# EAGLE design quadstep-v020 (EAGLE 6.4)
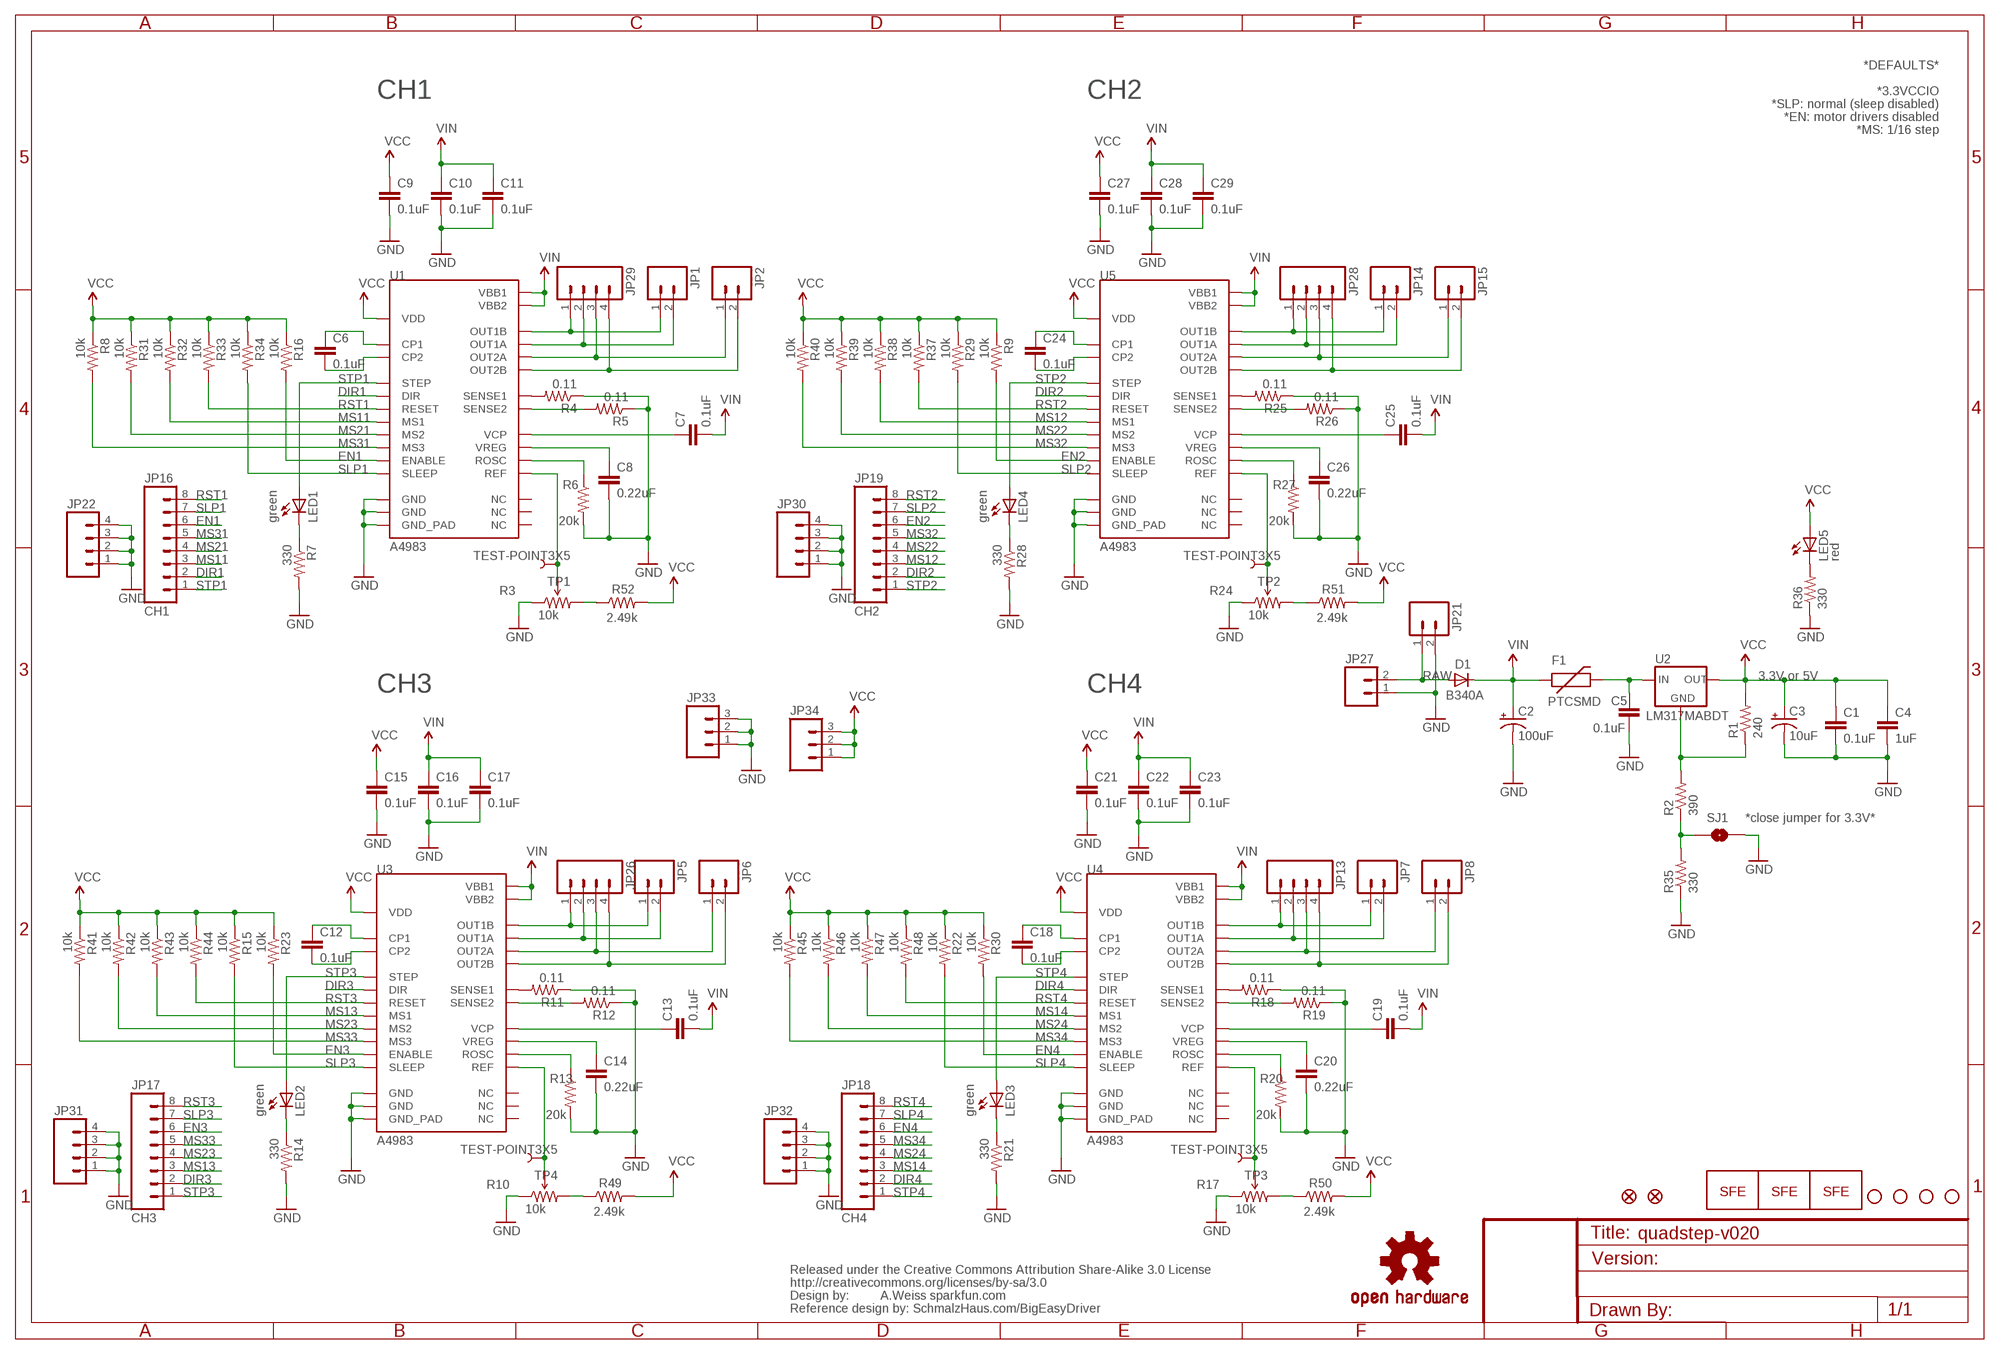
[diagram p0: schematic, sheet 1]

## Parts
C1  0.1uF  CAP0402-CAP  [0402-CAP]
C2  100uF  CAP_POLG  [PANASONIC_G]
C3  10uF  CAP_POL1206  [EIA3216]
C4  1uF  CAP0805  [0805]
C5  0.1uF  CAP0402-CAP  [0402-CAP]
C6  0.1uF  CAP0402-CAP  [0402-CAP]
C7  0.1uF  CAP0402-CAP  [0402-CAP]
C8  0.22uF  CAP0402-CAP  [0402-CAP]
C9  0.1uF  CAP0402-CAP  [0402-CAP]
C10  0.1uF  CAP0402-CAP  [0402-CAP]
C11  0.1uF  CAP0402-CAP  [0402-CAP]
C12  0.1uF  CAP0402-CAP  [0402-CAP]
C13  0.1uF  CAP0402-CAP  [0402-CAP]
C14  0.22uF  CAP0402-CAP  [0402-CAP]
C15  0.1uF  CAP0402-CAP  [0402-CAP]
C16  0.1uF  CAP0402-CAP  [0402-CAP]
C17  0.1uF  CAP0402-CAP  [0402-CAP]
C18  0.1uF  CAP0402-CAP  [0402-CAP]
C19  0.1uF  CAP0402-CAP  [0402-CAP]
C20  0.22uF  CAP0402-CAP  [0402-CAP]
C21  0.1uF  CAP0402-CAP  [0402-CAP]
C22  0.1uF  CAP0402-CAP  [0402-CAP]
C23  0.1uF  CAP0402-CAP  [0402-CAP]
C24  0.1uF  CAP0402-CAP  [0402-CAP]
C25  0.1uF  CAP0402-CAP  [0402-CAP]
C26  0.22uF  CAP0402-CAP  [0402-CAP]
C27  0.1uF  CAP0402-CAP  [0402-CAP]
C28  0.1uF  CAP0402-CAP  [0402-CAP]
C29  0.1uF  CAP0402-CAP  [0402-CAP]
CC_TEXT1  CREATIVE_COMMONS  [CREATIVE_COMMONS]
D1  B340A  DIODESMA  [SMA-DIODE]
F1  PTCSMD  [PTC-1206]
JP1  M023.5MM_LOCK  [SCREWTERMINAL-3.5MM-2_LOCK]
JP2  M023.5MM_LOCK  [SCREWTERMINAL-3.5MM-2_LOCK]
JP5  M023.5MM_LOCK  [SCREWTERMINAL-3.5MM-2_LOCK]
JP6  M023.5MM_LOCK  [SCREWTERMINAL-3.5MM-2_LOCK]
JP7  M023.5MM_LOCK  [SCREWTERMINAL-3.5MM-2_LOCK]
JP8  M023.5MM_LOCK  [SCREWTERMINAL-3.5MM-2_LOCK]
JP9  STAND-OFF  [STAND-OFF]
JP10  STAND-OFF  [STAND-OFF]
JP11  STAND-OFF  [STAND-OFF]
JP12  STAND-OFF  [STAND-OFF]
JP13  M04PTH  [1X04]
JP14  M023.5MM_LOCK  [SCREWTERMINAL-3.5MM-2_LOCK]
JP15  M023.5MM_LOCK  [SCREWTERMINAL-3.5MM-2_LOCK]
JP16  CH1  M08  [1X08]
JP17  CH3  M08  [1X08]
JP18  CH4  M08  [1X08]
JP19  CH2  M08  [1X08]
JP20  LOGO-SFENEW  [SFE-NEW-WEBLOGO]
JP21  M025MM  [SCREWTERMINAL-5MM-2]
JP22  M04PTH  [1X04]
JP23  LOGO-SFESK  [SFE-LOGO-FLAME]
JP24  FIDUCIAL1X2  [FIDUCIAL-1X2]
JP25  FIDUCIAL1X2  [FIDUCIAL-1X2]
JP26  M04PTH  [1X04]
JP27  M02PTH  [1X02]
JP28  M04PTH  [1X04]
JP29  M04PTH  [1X04]
JP30  M04PTH  [1X04]
JP31  M04PTH  [1X04]
JP32  M04PTH  [1X04]
JP33  M03PTH  [1X03]
JP34  M03PTH  [1X03]
LED1  green  LED0603  [LED-0603]
LED2  green  LED0603  [LED-0603]
LED3  green  LED0603  [LED-0603]
LED4  green  LED0603  [LED-0603]
LED5  red  LED0603  [LED-0603]
LOGO1  LOGO-SFENW2  [SFE-NEW-WEB]
R1  240  RESISTOR0402-RES  [0402-RES]
R2  390  RESISTOR0402-RES  [0402-RES]
R3  10k  TRIMPOTSMD  [TRIMPOT-3MM]
R4  0.11  RESISTOR2010  [R2010]
R5  0.11  RESISTOR2010  [R2010]
R6  20k  RESISTOR0402-RES  [0402-RES]
R7  330  RESISTOR0402-RES  [0402-RES]
R8  10k  RESISTOR0402-RES  [0402-RES]
R9  10k  RESISTOR0402-RES  [0402-RES]
R10  10k  TRIMPOTSMD  [TRIMPOT-3MM]
R11  0.11  RESISTOR2010  [R2010]
R12  0.11  RESISTOR2010  [R2010]
R13  20k  RESISTOR0402-RES  [0402-RES]
R14  330  RESISTOR0402-RES  [0402-RES]
R15  10k  RESISTOR0402-RES  [0402-RES]
R16  10k  RESISTOR0402-RES  [0402-RES]
R17  10k  TRIMPOTSMD  [TRIMPOT-3MM]
R18  0.11  RESISTOR2010  [R2010]
R19  0.11  RESISTOR2010  [R2010]
R20  20k  RESISTOR0402-RES  [0402-RES]
R21  330  RESISTOR0402-RES  [0402-RES]
R22  10k  RESISTOR0402-RES  [0402-RES]
R23  10k  RESISTOR0402-RES  [0402-RES]
R24  10k  TRIMPOTSMD  [TRIMPOT-3MM]
R25  0.11  RESISTOR2010  [R2010]
R26  0.11  RESISTOR2010  [R2010]
R27  20k  RESISTOR0402-RES  [0402-RES]
R28  330  RESISTOR0402-RES  [0402-RES]
R29  10k  RESISTOR0402-RES  [0402-RES]
R30  10k  RESISTOR0402-RES  [0402-RES]
R31  10k  RESISTOR0402-RES  [0402-RES]
R32  10k  RESISTOR0402-RES  [0402-RES]
R33  10k  RESISTOR0402-RES  [0402-RES]
R34  10k  RESISTOR0402-RES  [0402-RES]
R35  330  RESISTOR0402-RES  [0402-RES]
R36  330  RESISTOR0402-RES  [0402-RES]
R37  10k  RESISTOR0402-RES  [0402-RES]
R38  10k  RESISTOR0402-RES  [0402-RES]
R39  10k  RESISTOR0402-RES  [0402-RES]
R40  10k  RESISTOR0402-RES  [0402-RES]
R41  10k  RESISTOR0402-RES  [0402-RES]
R42  10k  RESISTOR0402-RES  [0402-RES]
R43  10k  RESISTOR0402-RES  [0402-RES]
R44  10k  RESISTOR0402-RES  [0402-RES]
R45  10k  RESISTOR0402-RES  [0402-RES]
R46  10k  RESISTOR0402-RES  [0402-RES]
R47  10k  RESISTOR0402-RES  [0402-RES]
R48  10k  RESISTOR0402-RES  [0402-RES]
R49  2.49k  RESISTOR0402-RES  [0402-RES]
R50  2.49k  RESISTOR0402-RES  [0402-RES]
R51  2.49k  RESISTOR0402-RES  [0402-RES]
R52  2.49k  RESISTOR0402-RES  [0402-RES]
SJ1  SOLDERJUMPERNO  [SJ_2S-NO]
TP1  TEST-POINT3X5  [PAD.03X.05]
TP2  TEST-POINT3X5  [PAD.03X.05]
TP3  TEST-POINT3X5  [PAD.03X.05]
TP4  TEST-POINT3X5  [PAD.03X.05]
U1  A4983  [QFN-28-5MM]
U2  LM317MABDT  V_REG_MC33269DT  [DPAK]
U3  A4983  [QFN-28-5MM]
U4  A4983  [QFN-28-5MM]
U5  A4983  [QFN-28-5MM]
U$1  OSHW-LOGOS  [OSHW-LOGO-S]

## Nets
DIR1: JP16.2 U1.P$19(DIR)
DIR2: JP19.2 U5.P$19(DIR)
DIR3: JP17.2 U3.P$19(DIR)
DIR4: JP18.2 U4.P$19(DIR)
EN1: JP16.6 R16.2 U1.P$2(ENABLE)
EN2: JP19.6 R9.2 U5.P$2(ENABLE)
EN3: JP17.6 R23.2 U3.P$2(ENABLE)
EN4: JP18.6 R30.2 U4.P$2(ENABLE)
GND: C1.2 C2.- C3.C(-) C4.2 C5.2 C8.2 C9.2 C10.2 C11.2 C14.2 C15.2 C16.2 C17.2 C20.2 C21.2 C22.2 C23.2 C26.2 C27.2 C28.2 C29.2 JP21.2 JP22.1 JP22.2 JP22.3 JP22.4 JP27.1 JP30.1 JP30.2 JP30.3 JP30.4 JP31.1 JP31.2 JP31.3 JP31.4 JP32.1 JP32.2 JP32.3 JP32.4 JP33.1 JP33.2 JP33.3 R3.1(CCW) R4.1 R5.1 R6.2 R7.2 R10.1(CCW) R11.1 R12.1 R13.2 R14.2 R17.1(CCW) R18.1 R19.1 R20.2 R21.2 R24.1(CCW) R25.1 R26.1 R27.2 R28.2 R35.1 R36.1 SJ1.2 U1.P$3(GND) U1.P$18(GND) U1.P$29(GND_PAD) U3.P$3(GND) U3.P$18(GND) U3.P$29(GND_PAD) U4.P$3(GND) U4.P$18(GND) U4.P$29(GND_PAD) U5.P$3(GND) U5.P$18(GND) U5.P$29(GND_PAD)
MS11: JP16.3 R32.2 U1.P$9(MS1)
MS12: JP19.3 R38.2 U5.P$9(MS1)
MS13: JP17.3 R43.2 U3.P$9(MS1)
MS14: JP18.3 R47.2 U4.P$9(MS1)
MS21: JP16.4 R31.2 U1.P$10(MS2)
MS22: JP19.4 R39.2 U5.P$10(MS2)
MS23: JP17.4 R42.2 U3.P$10(MS2)
MS24: JP18.4 R46.2 U4.P$10(MS2)
MS31: JP16.5 R8.2 U1.P$11(MS3)
MS32: JP19.5 R40.2 U5.P$11(MS3)
MS33: JP17.5 R41.2 U3.P$11(MS3)
MS34: JP18.5 R45.2 U4.P$11(MS3)
N$1: R1.1 R2.2 U2.1(GND)
N$2: JP7.1 JP13.1 U4.P$21(OUT1B)
N$3: JP1.2 JP29.2 U1.P$24(OUT1A)
N$4: C5.1 F1.2 U2.3(IN)
N$5: JP5.1 JP26.1 U3.P$21(OUT1B)
N$6: JP2.1 JP29.3 U1.P$26(OUT2A)
N$7: JP2.2 JP29.4 U1.P$1(OUT2B)
N$8: R4.2 U1.P$23(SENSE1)
N$9: R5.2 U1.P$27(SENSE2)
N$10: C7.1 U1.P$6(VCP)
N$11: C8.1 U1.P$8(VREG)
N$12: R6.1 U1.P$13(ROSC)
N$13: C6.1 U1.P$4(CP1)
N$14: R3.2(WIPER) TP1.P$1 U1.P$17(REF)
N$15: C6.2 U1.P$5(CP2)
N$16: R11.2 U3.P$23(SENSE1)
N$17: LED1.C R7.1
N$18: R12.2 U3.P$27(SENSE2)
N$19: C13.1 U3.P$6(VCP)
N$20: C14.1 U3.P$8(VREG)
N$21: R13.1 U3.P$13(ROSC)
N$22: R10.2(WIPER) TP4.P$1 U3.P$17(REF)
N$23: C12.1 U3.P$4(CP1)
N$24: R2.1 R35.2 SJ1.1
N$25: C12.2 U3.P$5(CP2)
N$26: LED2.C R14.1
N$27: LED5.C R36.2
N$28: R10.3(CW) R49.1
N$29: JP5.2 JP26.2 U3.P$24(OUT1A)
N$30: JP6.1 JP26.3 U3.P$26(OUT2A)
N$31: JP6.2 JP26.4 U3.P$1(OUT2B)
N$32: R18.2 U4.P$23(SENSE1)
N$33: R19.2 U4.P$27(SENSE2)
N$34: C19.1 U4.P$6(VCP)
N$35: C20.1 U4.P$8(VREG)
N$36: R20.1 U4.P$13(ROSC)
N$37: R17.2(WIPER) TP3.P$1 U4.P$17(REF)
N$38: C18.1 U4.P$4(CP1)
N$39: C18.2 U4.P$5(CP2)
N$40: LED3.C R21.1
N$41: JP14.1 JP28.1 U5.P$21(OUT1B)
N$42: JP7.2 JP13.2 U4.P$24(OUT1A)
N$43: JP8.1 JP13.3 U4.P$26(OUT2A)
N$44: JP8.2 JP13.4 U4.P$1(OUT2B)
N$45: R25.2 U5.P$23(SENSE1)
N$46: R26.2 U5.P$27(SENSE2)
N$47: C25.1 U5.P$6(VCP)
N$48: C26.1 U5.P$8(VREG)
N$49: R27.1 U5.P$13(ROSC)
N$50: R24.2(WIPER) TP2.P$1 U5.P$17(REF)
N$51: C24.1 U5.P$4(CP1)
N$52: C24.2 U5.P$5(CP2)
N$53: LED4.C R28.1
N$54: JP1.1 JP29.1 U1.P$21(OUT1B)
N$55: JP14.2 JP28.2 U5.P$24(OUT1A)
N$56: JP15.1 JP28.3 U5.P$26(OUT2A)
N$57: JP15.2 JP28.4 U5.P$1(OUT2B)
N$58: R17.3(CW) R50.1
N$59: R24.3(CW) R51.1
N$60: R3.3(CW) R52.1
RAW: D1.A JP21.1 JP27.2
RST1: JP16.8 R33.2 U1.P$12(RESET)
RST2: JP19.8 R37.2 U5.P$12(RESET)
RST3: JP17.8 R44.2 U3.P$12(RESET)
RST4: JP18.8 R48.2 U4.P$12(RESET)
SLP1: JP16.7 R34.2 U1.P$14(SLEEP)
SLP2: JP19.7 R29.2 U5.P$14(SLEEP)
SLP3: JP17.7 R15.2 U3.P$14(SLEEP)
SLP4: JP18.7 R22.2 U4.P$14(SLEEP)
STP1: JP16.1 LED1.A U1.P$16(STEP)
STP2: JP19.1 LED4.A U5.P$16(STEP)
STP3: JP17.1 LED2.A U3.P$16(STEP)
STP4: JP18.1 LED3.A U4.P$16(STEP)
VCC: C1.1 C3.A(+) C4.1 C9.1 C15.1 C21.1 C27.1 JP34.1 JP34.2 JP34.3 LED5.A R1.2 R8.1 R9.1 R15.1 R16.1 R22.1 R23.1 R29.1 R30.1 R31.1 R32.1 R33.1 R34.1 R37.1 R38.1 R39.1 R40.1 R41.1 R42.1 R43.1 R44.1 R45.1 R46.1 R47.1 R48.1 R49.2 R50.2 R51.2 R52.2 U1.P$15(VDD) U2.4(OUT) U3.P$15(VDD) U4.P$15(VDD) U5.P$15(VDD)
VIN: C2.+ C7.2 C10.1 C11.1 C13.2 C16.1 C17.1 C19.2 C22.1 C23.1 C25.2 C28.1 C29.1 D1.C F1.1 U1.P$22(VBB1) U1.P$28(VBB2) U3.P$22(VBB1) U3.P$28(VBB2) U4.P$22(VBB1) U4.P$28(VBB2) U5.P$22(VBB1) U5.P$28(VBB2)
Unconnected: U1.P$7(NC) U1.P$20(NC) U1.P$25(NC) U3.P$7(NC) U3.P$20(NC) U3.P$25(NC) U4.P$7(NC) U4.P$20(NC) U4.P$25(NC) U5.P$7(NC) U5.P$20(NC) U5.P$25(NC)

## Notes on the sheet
- *DEFAULTS*
- *3.3VCCIO
- CH1 | CH2 | *SLP: normal (sleep disabled)
- *EN: motor drivers disabled
- *MS: 1/16 step
- 3.3V or 5V
- CH3 | CH4
- *close jumper for 3.3V*
- A.Weiss sparkfun.com
- Reference design by: SchmalzHaus.com/BigEasyDriver

## Library data of the parts
C1 C4-C29 = SparkFun:CAP: Capacitor Standard 0603 ceramic capacitor, and 0.1" leaded capacitor.
C2 C3 = SparkFun:CAP_POL: Capacitor Polarized These are standard SMD and PTH capacitors. Normally 10uF, 47uF, and 100uF in electrolytic and tantalum varieties. Always verify the external diameter of the through hole cap, it varies with capacity, voltage, and manufacturer. The EIA devices should be standard.
CC_TEXT1 = SparkFun-Aesthetics:CREATIVE_COMMONS: Creative Commons License summary
D1 = SparkFun:DIODE: Diode These are standard reverse protection diodes and small signal diodes. SMA package can handle up to about 1A. SOD-323 can handle about 200mA. What the SOD-323 package when ordering, there are some mfgs out there that are 5-pin packages.
F1 = SparkFun:PTC: Resettable Fuse PTC Resettable Fuse. Spark Fun Electronics SKU : COM-08357
JP1 JP2 JP5-JP8 JP14 JP15 JP21 = SparkFun:M02: Header 2 Standard 2-pin 0.1" header. Use with straight break away headers (SKU : PRT-00116), right angle break away headers (PRT-00553), swiss pins (PRT-00743), machine pins (PRT-00117), and female headers (PRT-00115). Molex polarized connector foot print use with SKU : PRT-08233 with associated crimp pins and housings.
JP9-JP12 = SparkFun:STAND-OFF: Stand Off This is the mechanical footprint for a #4 phillips button head screw. Use the keepout ring to avoid running the screw head into surrounding components. SKU : PRT-00447
JP13 JP22 JP26 JP28-JP32 = SparkFun-Connectors:M04: Header 4 Standard 4-pin 0.1" header. Use with straight break away headers (SKU : PRT-00116), right angle break away headers (PRT-00553), swiss pins (PRT-00743), machine pins (PRT-00117), and female headers (PRT-00115). Molex polarized connector foot print use with SKU : PRT-08231 with associated crimp pins and housings. 1MM SMD Version SKU: PRT-10208
JP16-JP19 = SparkFun:M08: Header 8 Standard 8-pin 0.1" header. Use with straight break away headers (SKU : PRT-00116), right angle break away headers (PRT-00553), swiss pins (PRT-00743), machine pins (PRT-00117), and female headers (PRT-00115).
JP20 JP23 = SparkFun:LOGO-SFE: Spark Fun Electronics PCB Logo This is the standard Spark Fun Electronics PCB logo.
JP24 JP25 = SparkFun:FIDUCIAL: Fiducial Alignment Points Various fiducial points for machine vision alignment.
JP27 = SparkFun-Connectors:M02: Header 2 Standard 2-pin 0.1" header. Use with straight break away headers (SKU : PRT-00116), right angle break away headers (PRT-00553), swiss pins (PRT-00743), machine pins (PRT-00117), and female headers (PRT-00115). Molex polarized connector foot print use with SKU : PRT-08233 with associated crimp pins and housings.
JP33 JP34 = SparkFun-Connectors:M03: Header 3 Standard 3-pin 0.1" header. Use with straight break away headers (SKU : PRT-00116), right angle break away headers (PRT-00553), swiss pins (PRT-00743), machine pins (PRT-00117), and female headers (PRT-00115). Molex polarized connector foot print use with SKU : PRT-08232 with associated crimp pins and housings.
LED1-LED5 = SparkFun:LED: LEDs Standard schematic elements and footprints for 5mm, 3mm, 1206, and 0603 sized LEDs. 5mm - Spark Fun Electronics SKU : COM-00529 (and others)
LOGO1 = SparkFun-Aesthetics:LOGO-SFE: Spark Fun Electronics PCB Logo This is the standard Spark Fun Electronics PCB logo.
R1 R2 R4-R9 R11-R16 R18-R23 R25-R52 = SparkFun:RESISTOR: Resistor Basic schematic elements and footprints for 0603, 1206, and PTH resistors.
R3 R10 R17 R24 = SparkFun:TRIMPOT
SJ1 = SparkFun:SOLDERJUMPER: Solder Jumper Standard SMD solder jumper. Used to automate production. Two varients : Normally Open and Normally Closed are the same, but have different paste layers. NC will have a large amount of paste and should jumper during reflow.
TP1-TP4 = SparkFun:TEST-POINT
U1 U3-U5 = SparkFun:A4983: DMOS Microstepping Driver with Translator
U2 = SparkFun:V_REG_MC33269
U$1 = SparkFun-Aesthetics:OSHW-LOGO: Open Source Hardware Logo This logo indicates the piece of hardware it is found on incorporates a OSHW license and/or adheres to the definition of open source hardware found here: http://freedomdefined.org/OSHW

## Board
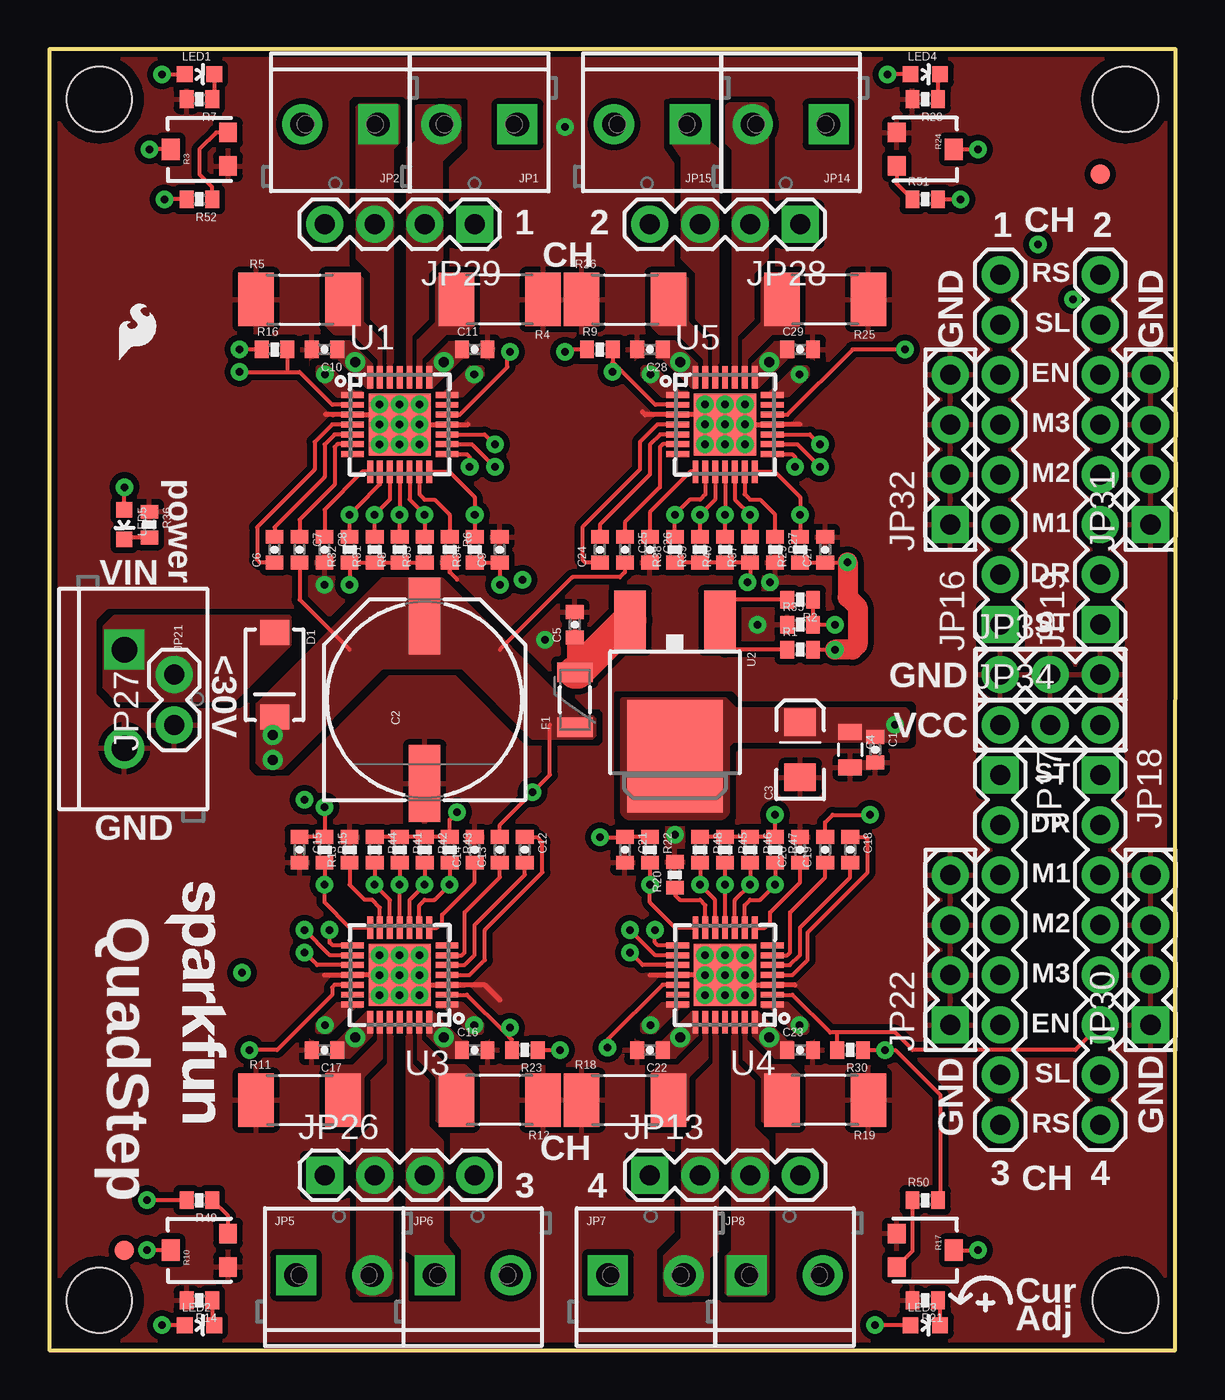
[diagram p1: board, top side]
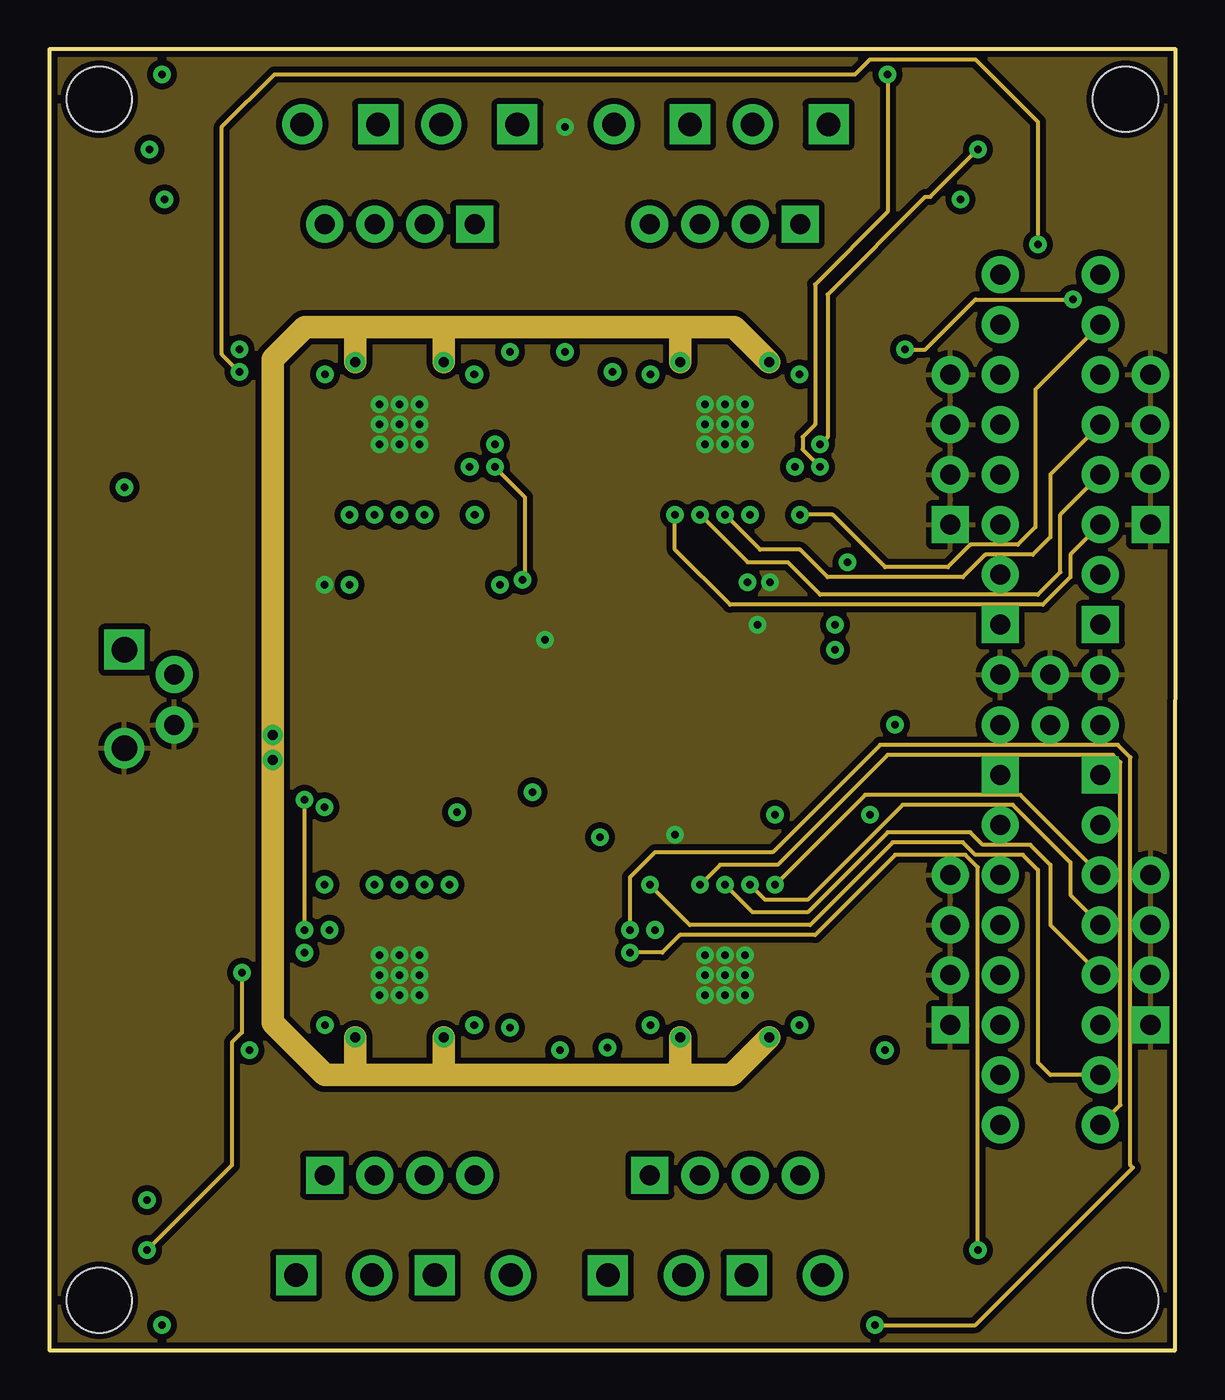
[diagram p2: board, inner layer Route2]
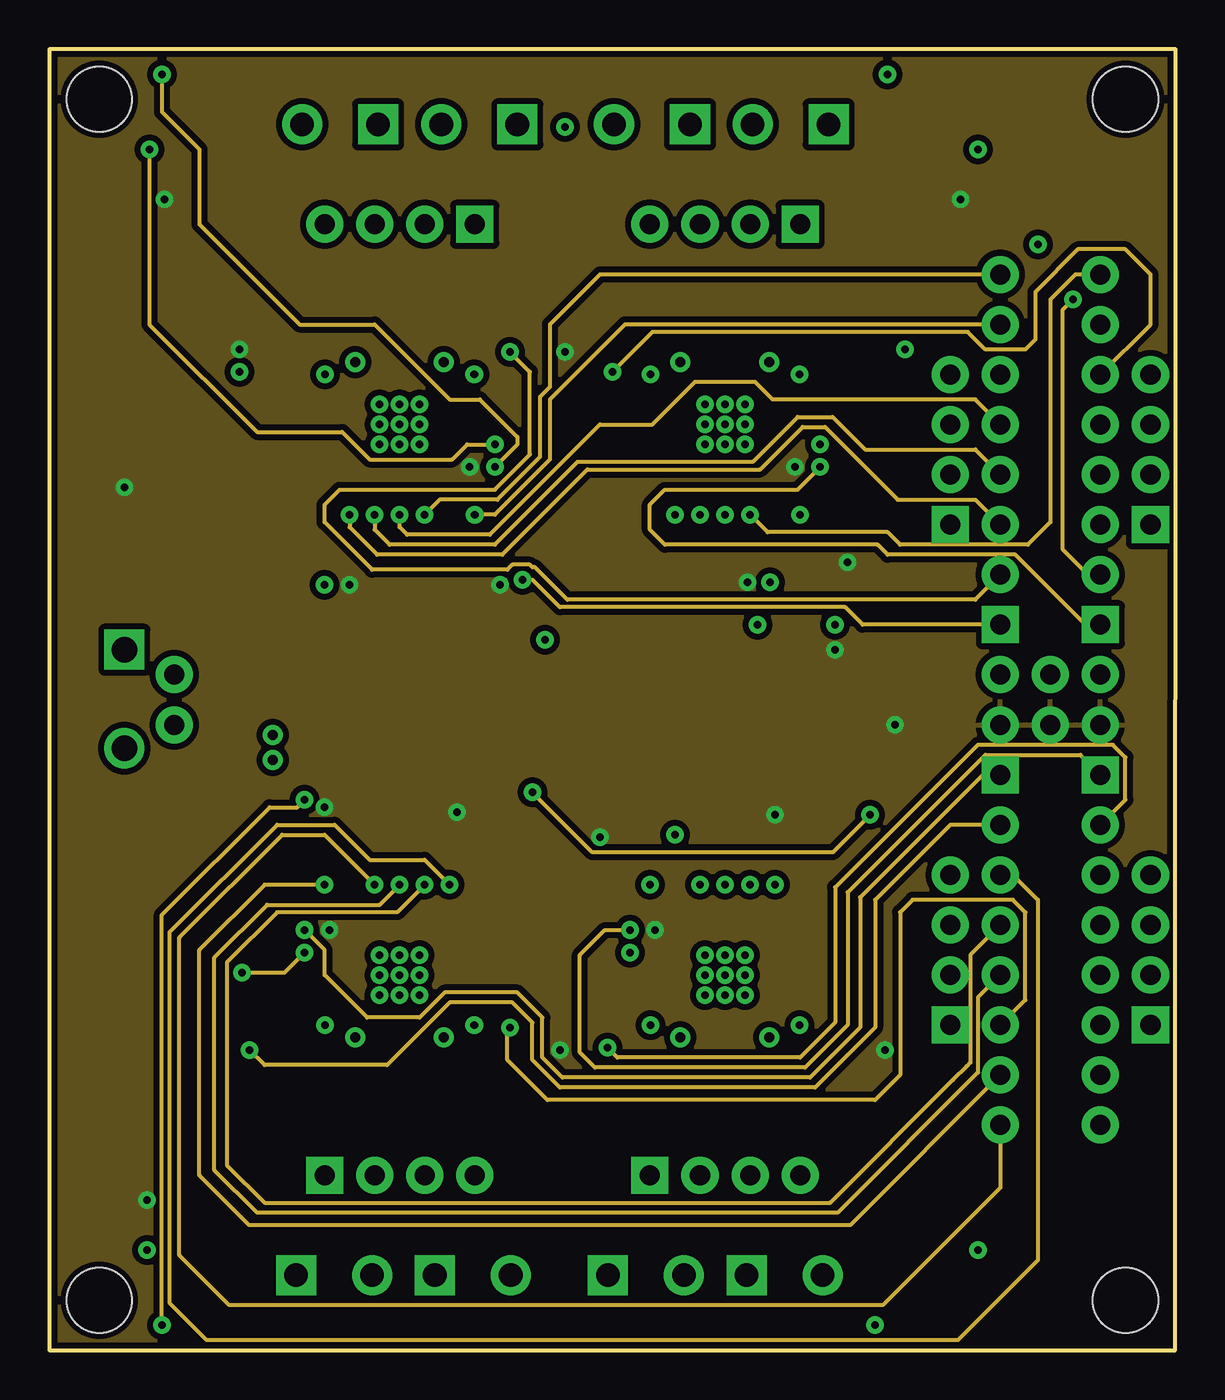
[diagram p3: board, inner layer Route15]
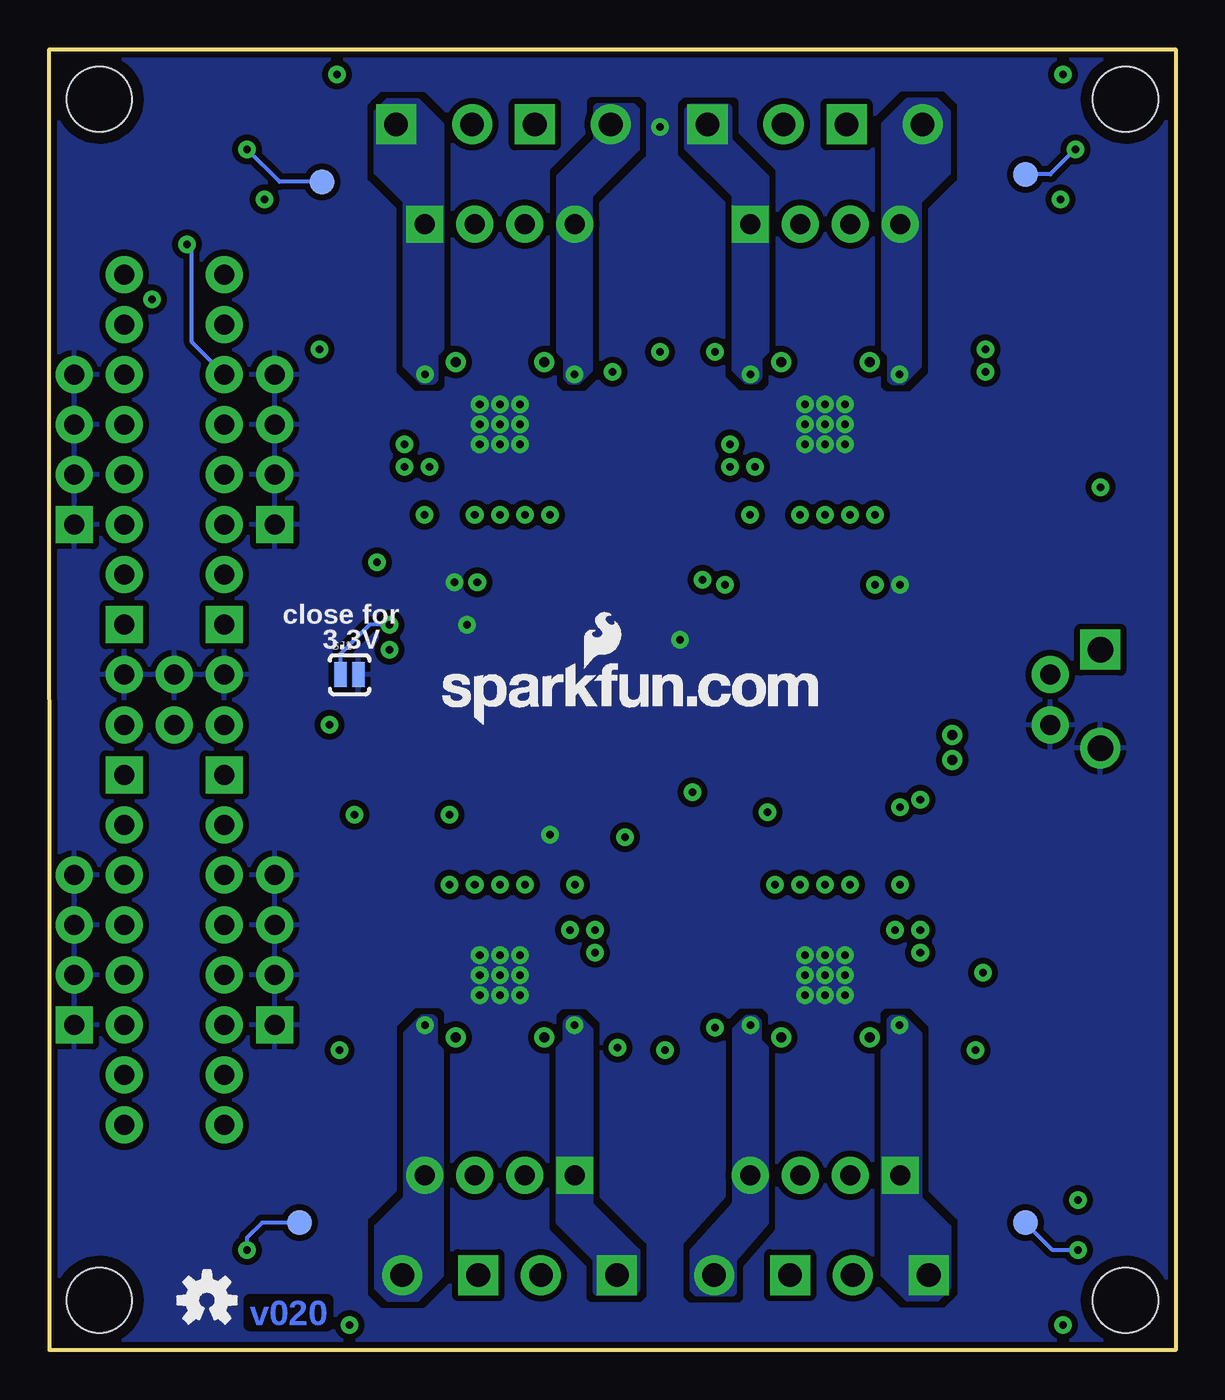
[diagram p4: board, bottom side, seen from below]

Size 57.15 x 66.04 mm. Coordinates in mm from the lower left corner, seen from the top.
Outline: 0,0 57.13,0 57.15,66.04 0,66.04 0,0
Copper layers (1*2*15*16): Top 0.035mm / dielectric 1.5mm / Route2 0.035mm / dielectric 0.15mm / Route15 0.035mm / dielectric 0.2mm / Bottom 0.035mm
Design rules "BatchPCB-4-layer": minimum track width 6mil, minimum drill 13mil, track to track 6mil, track to pad 6mil, pad to pad 6mil, via to via 6mil, smd to smd 6mil, copper to edge 6mil, drill to drill 8mil, minimum pad ring 12mil, minimum via ring 10mil, stop-mask expansion 4mil, vias tented up to drill 20mil, thermal gap 12mil

### Footprints (pad centres in the part's own frame; a part is rotated, then mirrored left to right if it is on the bottom)
0402-CAP = smd 0.7 x 0.9: 1 -0.65,0; 2 0.65,0
PANASONIC_G = smd 3.9 x 1.6: + 4.25,0; - -4.25,0
EIA3216 = smd 1.4 x 1.6: A 1.4,0; C -1.4,0
0805 = smd 0.8 x 1.2: 1 -0.9,0; 2 0.9,0
SMA-DIODE = smd 1.27 x 1.47: A -2.15,0; C 2.15,0
PTC-1206 = smd 1 x 1.8: 1 -1.4,0; 2 1.4,0
SCREWTERMINAL-3.5MM-2_LOCK = drill 1.2 pad 2.032 square: 1 -0.178,0 | drill 1.2 pad 2.032: 2 3.678,0
STAND-OFF = hole 3.302: 0,0
1X04 = drill 1.016 pad 1.88 square: 1 0,0 | drill 1.016 pad 1.88: 2 2.54,0; 3 5.08,0; 4 7.62,0
1X08 = drill 1.016 pad 1.88 square: 1 0,0 | drill 1.016 pad 1.88: 2 2.54,0; 3 5.08,0; 4 7.62,0; 5 10.16,0; 6 12.7,0; 7 15.24,0; 8 17.78,0
SCREWTERMINAL-5MM-2 = drill 1.3 pad 2.032 square: 1 0,0 | drill 1.3 pad 2.032: 2 5,0
FIDUCIAL-1X2 = smd 1 x 1: 1 0,0
1X02 = drill 1.016 pad 1.88: 1 0,0; 2 2.54,0
1X03 = drill 1.016 pad 1.88: 1 0,0; 2 2.54,0; 3 5.08,0
LED-0603 = smd 0.8 x 0.8: A 0,-0.75; C 0,0.75
0402-RES = smd 0.7 x 0.9: 1 -0.65,0; 2 0.65,0
TRIMPOT-3MM = smd 1 x 0.9: 1 -0.85,-1.45; 3 0.85,-1.45 | smd 1.1 x 0.9: 2 0,1.45
R2010 = smd 1.8 x 2.7: 1 -2.2,0; 2 2.2,0
SJ_2S-NO = smd 0.635 x 1.27: 1 -0.45,0; 2 0.45,0
PAD.03X.05 = smd 1.27 x 1.27: P$1 0,0
QFN-28-5MM = smd 1.15 x 0.3: P$1 -2.4,1.5; P$2 -2.4,1; P$3 -2.4,0.5; P$4 -2.4,0; P$5 -2.4,-0.5; P$6 -2.4,-1; P$7 -2.4,-1.5; P$15 2.4,-1.5; P$16 2.4,-1; P$17 2.4,-0.5; P$18 2.4,0; P$19 2.4,0.5; P$20 2.4,1; P$21 2.4,1.5 | smd 0.3 x 1.15: P$8 -1.5,-2.4; P$9 -1,-2.4; P$10 -0.5,-2.4; P$11 0,-2.4; P$12 0.5,-2.4; P$13 1,-2.4; P$14 1.5,-2.4; P$22 1.5,2.4; P$23 1,2.4; P$24 0.5,2.4; P$25 0,2.4; P$26 -0.5,2.4; P$27 -1,2.4; P$28 -1.5,2.4 | smd 3.15 x 3.15: P$29 0,0
DPAK = smd 1.6 x 3: 1 -2.28,-5.31; 3 2.28,-5.31 | smd 4.826 x 5.715: 4 0,1.588

### Placement (x,y rotation side)
C1  41.91,30.48 270 top
C2  19.05,33.02 90 top
C3  38.1,30.48 90 top
C4  40.64,30.48 270 top
C5  26.67,36.83 90 top
C6  11.43,40.64 90 top
C7  12.7,40.64 270 top
C8  13.97,40.64 270 top
C9  22.86,40.64 90 top
C10  13.97,50.8 180 top
C11  21.59,50.8 0 top
C12  24.13,25.4 270 top
C13  22.86,25.4 90 top
C14  21.59,25.4 90 top
C15  12.7,25.4 270 top
C16  21.59,15.24 0 top
C17  13.97,15.24 180 top
C18  40.64,25.4 270 top
C19  39.37,25.4 90 top
C20  38.1,25.4 90 top
C21  29.21,25.4 270 top
C22  30.48,15.24 180 top
C23  38.1,15.24 0 top
C24  27.94,40.64 90 top
C25  29.21,40.64 270 top
C26  30.48,40.64 270 top
C27  39.37,40.64 90 top
C28  30.48,50.8 180 top
C29  38.1,50.8 0 top
CC_TEXT1  -2.54,-13.97 0 top  (outside the outline)
D1  11.43,34.29 270 top
F1  26.67,33.02 90 top
JP1  23.57,62.23 180 top
JP2  16.51,62.23 180 top
JP5  12.7,3.81 0 top
JP6  19.74,3.81 0 top
JP7  28.52,3.81 0 top
JP8  35.56,3.81 0 top
JP9  2.54,2.54 0 top
JP10  54.61,2.54 0 top
JP11  2.54,63.5 0 top
JP12  54.61,63.5 0 top
JP13  30.48,8.89 0 top
JP14  39.37,62.23 180 top
JP15  32.33,62.23 180 top
JP16  48.26,36.83 90 top
JP17  48.26,29.21 270 top
JP18  53.34,29.21 270 top
JP19  53.34,36.83 90 top
JP20  37.21,31.75 0 bottom
JP21  3.81,35.56 270 top
JP22  45.72,16.51 90 top
JP23  3.56,50.29 0 top
JP24  53.34,59.69 0 top
JP25  3.81,5.08 0 top
JP26  13.97,8.89 0 top
JP27  6.35,31.75 90 top
JP28  38.1,57.15 180 top
JP29  21.59,57.15 180 top
JP30  55.88,16.51 90 top
JP31  55.88,41.91 90 top
JP32  45.72,41.91 90 top
JP33  48.26,34.29 0 top
JP34  48.26,31.75 0 top
LED1  7.62,64.77 270 top
LED2  7.62,1.27 270 top
LED3  44.45,1.27 270 top
LED4  44.45,64.77 270 top
LED5  3.81,41.91 180 top
LOGO1  5.84,23.75 270 top
R1  38.1,35.56 0 top
R2  38.1,38.1 180 top
R3  7.62,60.96 90 top
R4  22.86,53.34 180 top
R5  12.7,53.34 0 top
R6  20.32,40.64 270 top
R7  7.62,63.5 180 top
R8  17.78,40.64 90 top
R9  27.94,50.8 0 top
R10  7.62,5.08 90 top
R11  12.7,12.7 0 top
R12  22.86,12.7 180 top
R13  15.24,25.4 90 top
R14  7.62,2.54 180 top
R15  13.97,25.4 270 top
R16  11.43,50.8 0 top
R17  44.45,5.08 270 top
R18  29.21,12.7 0 top
R19  39.37,12.7 180 top
R20  31.75,24.13 90 top
R21  44.45,2.54 180 top
R22  30.48,25.4 270 top
R23  24.13,15.24 180 top
R24  44.45,60.96 270 top
R25  39.37,53.34 180 top
R26  29.21,53.34 0 top
R27  36.83,40.64 270 top
R28  44.45,63.5 180 top
R29  38.1,40.64 90 top
R30  40.64,15.24 180 top
R31  16.51,40.64 90 top
R32  15.24,40.64 90 top
R33  19.05,40.64 90 top
R34  21.59,40.64 90 top
R35  38.1,36.83 0 top
R36  5.08,41.91 270 top
R37  35.56,40.64 90 top
R38  31.75,40.64 90 top
R39  33.02,40.64 90 top
R40  34.29,40.64 90 top
R41  17.78,25.4 270 top
R42  19.05,25.4 270 top
R43  20.32,25.4 270 top
R44  16.51,25.4 270 top
R45  34.29,25.4 270 top
R46  35.56,25.4 270 top
R47  36.83,25.4 270 top
R48  33.02,25.4 270 top
R49  7.62,7.62 180 top
R50  44.45,7.62 0 top
R51  44.45,58.42 0 top
R52  7.62,58.42 180 top
SJ1  41.91,34.29 0 bottom
TP1  7.62,59.69 0 bottom
TP2  43.31,59.31 0 bottom
TP3  44.45,6.48 0 bottom
TP4  7.62,6.48 0 bottom
U1  17.78,46.99 0 top
U2  31.75,31.75 180 top
U3  17.78,19.05 180 top
U4  34.29,19.05 180 top
U5  34.29,46.99 0 top
U$1  49.15,2.54 0 bottom

### Tracks (layer width: path | path; a pad name or v marks a point on that pad's centre or on a via)
DIR1  (via drill 0.38)
  Top 0.203: U1.P$19 20.82,47.49 23.24,49.91 23.24,50.67 v23.37,50.67
  Route15 0.203: JP16.2 46.99,38.1 26.29,38.1 24.64,39.75 24.51,39.75 24.38,39.88 23.5,39.88 23.24,39.62 16.38,39.62 13.97,42.04 13.97,42.93 14.73,43.69 22.61,43.69 24.38,45.47 24.38,49.66 v23.37,50.67
DIR2  (via drill 0.38)
  Top 0.203: U5.P$19 37.46,47.49 40.77,50.8 v43.43,50.8
  Route2 0.203: v43.43,50.8 44.45,50.8 46.99,53.34 v51.94,53.34
  Route15 0.203: JP19.2 52.7,39.37 51.44,40.64 51.44,52.83 v51.94,53.34
DIR3  (via drill 0.38)
  Top 0.203: U3.P$19 14.49,18.55 14.35,18.41 14.35,18.03 11.56,15.24 v10.16,15.24
  Route15 0.203: JP17.2 45.72,26.67 41.91,22.86 41.91,16.38 38.86,13.34 25.91,13.34 24.51,14.73 24.51,16.64 23.5,17.65 20.32,17.65 17.14,14.48 10.92,14.48 v10.16,15.24
DIR4  (via drill 0.38)
  Top 0.203: v28.32,15.37 28.32,15.75 31.12,18.55 U4.P$19
  Route15 0.203: JP18.2 54.61,27.94 54.61,30.1 53.98,30.73 47.12,30.73 39.88,23.5 39.88,16.64 38.1,14.86 28.83,14.86 v28.32,15.37
EN1  (via drill 0.38)
  Top 0.203: U1.P$2 14.37,47.99 12.7,49.66 12.06,49.66 | v9.65,49.66 12.06,49.66 | R16.2 12.08,49.67 12.06,49.66
  Route2 0.203: v9.65,49.66 8.76,50.55 8.76,62.1 11.43,64.77 40.89,64.77 41.66,65.53 46.99,65.53 50.16,62.36 v50.16,56.13
  Bottom 0.203: JP16.6 49.91,51.18 49.91,55.88 v50.16,56.13
EN2  (via drill 0.38)
  Top 0.203: U5.P$2 30.75,47.99 28.59,50.15 | R9.2 28.59,50.15 | v28.57,49.66 28.57,50.13 28.59,50.15
  Route15 0.203: JP19.6 55.88,52.07 55.88,54.61 54.61,55.88 52.2,55.88 50.04,53.72 50.04,51.31 49.53,50.8 47.5,50.8 46.61,51.69 30.61,51.69 v28.57,49.66
EN3  (via drill 0.38)
  Top 0.203: U3.P$2 21.19,18.05 23.11,16.13 | 23.11,16.13 23.48,15.76 R23.2 | v23.37,16.38 23.11,16.13
  Route15 0.203: JP17.6 49.53,17.78 49.53,22.23 48.9,22.86 43.81,22.86 43.18,22.23 43.18,13.97 41.91,12.7 25.27,12.7 23.24,14.73 23.24,16.26 v23.37,16.38
EN4
  Top 0.203: U4.P$2 37.7,18.05 39.62,16.13 40.01,16.13 | JP18.6 52.07,15.24 43.81,15.24 42.93,16.13 40.01,16.13 | R30.2 39.99,16.11 40.01,16.13
GND  (via drill 0.38)
  Top 0.203: R6.2 20.32,39.5 20.7,39.12 | U1.P$18 19.94,46.99
  Top 0.254: U1.P$18 21.26,46.99 | 14.02,47.5 14.41,47.49 U1.P$3 16.26,47.49 v16.76,46.99 | 19.05,46.99 19.94,46.99 | v33.27,46.99 33.02,46.99 33.02,47.5 32.26,47.5 | v35.31,46.99 U5.P$18 38.1,46.99 | v16.76,19.05 U3.P$18 13.97,19.05 | v18.8,18.03 18.8,18.16 19.18,18.54 21.08,18.54 | U3.P$3 22.1,18.54 22.86,17.78 | v33.27,19.05 U4.P$18 30.48,19.05 | v35.31,19.05 35.31,18.8 35.56,18.54 U4.P$3 | 37.85,18.54 U4.P$3 | U4.P$3 | U5.P$3 30.23,47.49 30.1,47.62
  other vias: 17.78,46.99 16.76,48.01 17.78,48.01 18.8,48.01 18.8,46.99 16.76,45.97 17.78,45.97 18.8,45.97 34.29,46.99 33.27,48.01 34.29,48.01 35.31,48.01 35.31,45.97 34.29,45.97 33.27,45.97 16.76,20.07 17.78,20.07 18.8,20.07 18.8,19.05 17.78,19.05 16.76,18.03 17.78,18.03 33.27,18.03 34.29,18.03 35.31,18.03 34.29,19.05 33.27,20.07 34.29,20.07 35.31,20.07 35.94,36.83 13.97,38.86 31.75,26.16 36.58,38.99 25.15,36.07 26.16,62.1
  pour Bottom (isolate 0.305, rank 2): 0,69.85 0,0 57.15,0 57.15,69.85
  pour Top (isolate 0.305, rank 2): 0,71.12 0,0 57.15,0 57.15,71.12
  pour Route2 (isolate 0.305): 0,67.31 0,0 57.15,0 57.15,67.31
MS11  (via drill 0.38)
  Top 0.203: U1.P$9 16.78,43.96 15.62,42.8 v15.24,42.42 R32.2
  Route15 0.203: JP16.3 46.99,43.18 43.05,43.18 39.37,46.86 38.23,46.86 36.07,44.7 27.3,44.7 22.99,40.39 16.64,40.39 15.24,41.78 v15.24,42.42
MS12  (via drill 0.38)
  Top 0.203: U5.P$9 33.29,43.45 33.02,43.18 32.51,43.18 v31.75,42.42 R38.2
  Route2 0.203: v31.75,42.42 31.75,40.64 34.54,37.85 50.42,37.85 51.82,39.24 51.82,40.39 JP19.3
MS13  (via drill 0.38)
  Top 0.203: U3.P$9 18.78,22.59 19.05,22.86 19.56,22.86 v20.32,23.62 R43.2
  Route15 0.203: JP17.3 48.9,24.13 50.16,22.86 50.16,4.57 46.1,0.51 8,0.51 6.1,2.41 6.1,21.21 11.56,26.67 14.48,26.67 16.26,24.89 19.05,24.89 v20.32,23.62
MS14  (via drill 0.38)
  Top 0.203: U4.P$9 35.29,22.59 35.56,22.86 36.07,22.86 v36.83,23.62 R47.2
  Route2 0.203: JP18.3 49.28,28.19 41.4,28.19 v36.83,23.62
MS21  (via drill 0.38)
  Top 0.203: U1.P$10 17.28,43.19 16.89,42.8 v16.51,42.42 R31.2
  Route15 0.203: JP16.4 46.99,45.72 41.4,45.72 39.75,47.37 37.97,47.37 35.69,45.09 26.8,45.09 22.61,40.89 17.27,40.89 16.51,41.66 v16.51,42.42
MS22  (via drill 0.38)
  Top 0.203: U5.P$10 33.79,43.19 v33.02,42.42 R39.2
  Route2 0.203: v33.02,42.42 35.43,40.01 37.47,40.01 39.12,38.35 50.16,38.35 51.31,39.5 51.31,42.42 JP19.4
MS23  (via drill 0.38)
  Top 0.203: U3.P$10 18.28,22.85 v19.05,23.62 R42.2
  Route15 0.203: JP17.4 46.74,20.07 46.74,14.61 46.55,14.41 45.85,13.72 39.62,7.49 10.92,7.49 9.02,9.4 9.02,19.68 11.56,22.23 17.65,22.23 v19.05,23.62
MS24  (via drill 0.38)
  Top 0.203: U4.P$10 34.79,22.85 v35.56,23.62 R46.2
  Route2 0.203: v35.56,23.62 36.32,22.86 38.48,22.86 43.31,27.69 48.9,27.69 51.82,24.77 51.82,23.11 JP18.4
MS31  (via drill 0.38)
  Top 0.203: U1.P$11 v17.78,42.42 R8.2
  Route15 0.203: JP16.5 46.99,48.26 36.7,48.26 35.81,49.15 32.77,49.15 30.61,46.99 27.94,46.99 22.35,41.4 18.16,41.4 17.78,41.78 v17.78,42.42
MS32  (via drill 0.38)
  Top 0.203: U5.P$11 v34.29,42.42 R40.2
  Route2 0.203: v34.29,42.42 36.07,40.64 38.1,40.64 39.5,39.24 46.35,39.24 47.5,40.39 49.91,40.39 50.8,41.27 50.8,44.45 JP19.5
MS33  (via drill 0.38)
  Top 0.203: U3.P$11 v17.78,23.62 R41.2
  Route15 0.203: v17.78,23.62 16.76,22.61 11.05,22.61 8.38,19.94 8.38,9.14 10.54,6.99 40.01,6.99 47.12,14.1 47.12,17.91 JP17.5
MS34  (via drill 0.38)
  Top 0.203: U4.P$11 v34.29,23.62 R45.2
  Route2 0.203: v34.29,23.62 35.69,22.23 38.48,22.23 42.55,26.29 46.74,26.29 47.37,25.65 49.78,25.65 50.8,24.64 50.8,21.59 JP18.5
N$1
  Top 0.203: R2.2 34.29,38.1 34.29,37.32 U2.1 34.29,36.8 34.29,35.56 R1.1
N$2  (via drill 0.38)
  other vias: 30.51,16.51
  pour Top (isolate 0.203, no thermals): 32.36,17.45 32,17.45 30.73,16.18 30.68,16.13 30.18,16.13 30.1,16.21 30.1,16.56 31.11,17.58 32.36,17.58
  pour Bottom (isolate 0.203, no thermals): 30.28,16.92 29.64,16.28 29.64,7.44 27.25,5.05 27.25,3.07 27.48,2.84 29.36,2.84 29.46,2.95 29.46,4.6 31.34,6.48 31.34,15.34 30.99,15.7 30.99,16.69 30.76,16.92
N$3
  pour Top (isolate 0.203, no thermals): 18.34,48.95 18.34,51.54 19.18,52.37 19.18,54.71 19.91,55.45 19.89,60.4 20.83,61.32 20.83,63.12 18.64,63.12 18.64,61.34 18.19,60.99 18.19,48.95
N$4
  Top 0.813: C5.1 F1.2
  Top 1.676: F1.2 26.8,34.42 29.21,36.83 29.24,36.83 U2.3
N$5  (via drill 0.38)
  other vias: 14,16.51
  pour Top (isolate 0.203, no thermals): 15.85,17.45 15.49,17.45 14.22,16.18 14.17,16.13 13.67,16.13 13.59,16.21 13.59,16.56 14.61,17.58 15.85,17.58
  pour Bottom (isolate 0.203, no thermals): 14.43,16.92 14.4,16.92 14.38,16.94 13.82,16.94 12.95,16.08 12.95,7.75 11.48,6.27 11.48,3.17 12.09,2.57 13.61,2.57 14.86,3.81 14.86,15.21 14.55,15.52 14.55,16.79
N$6
  pour Top (isolate 0.203, no thermals): 17.22,48.95 17.22,51.54 16.38,52.37 16.38,54.71 15.65,55.45 15.65,63.09 15.77,63.22 17.6,63.22 17.7,63.12 17.7,61.32 17.37,60.99 17.37,48.95
N$7  (via drill 0.38)
  other vias: 14,49.53
  pour Top (isolate 0.203, no thermals): 15.85,48.59 15.49,48.59 14.22,49.86 14.17,49.91 13.67,49.91 13.59,49.83 13.59,49.48 14.61,48.46 15.85,48.46
  pour Bottom (isolate 0.203, no thermals): 14.43,49.12 14.4,49.12 14.38,49.1 13.82,49.1 12.95,49.96 12.95,58.29 11.48,59.77 11.48,62.87 12.09,63.47 13.61,63.47 14.05,63.04 14.76,62.33 14.86,62.23 14.86,50.83 14.55,50.52 14.55,49.25
N$8
  pour Top (isolate 0.203, no thermals): 18.75,48.92 18.75,51.23 19.68,52.17 19.68,54.36 19.86,54.53 21.26,54.53 21.41,54.38 21.41,51.97 21.08,51.64 20.12,51.64 18.87,50.39 18.85,50.37 18.82,50.34 18.82,48.92
N$9
  pour Top (isolate 0.203, no thermals): 16.81,48.92 16.81,51.23 15.88,52.17 15.88,54.36 15.7,54.53 14.3,54.53 14.15,54.38 14.15,51.97 14.48,51.64 15.44,51.64 16.69,50.39 16.71,50.37 16.74,50.34 16.74,48.92
N$10
  Top 0.203: U1.P$6 14.62,45.99 14.48,45.85 14.48,43.94 12.7,42.16 C7.1
N$11
  Top 0.203: U1.P$8 15.89,44.59 13.97,42.67 C8.1
N$12
  Top 0.203: U1.P$13 18.78,43.45 19.05,43.18 19.56,43.18 20.32,42.42 R6.1
N$13
  Top 0.203: U1.P$4 14.35,46.99 13.46,46.1 13.46,44.7 10.54,41.78 10.54,40.13 10.68,39.99 C6.1
N$14  (via drill 0.38)
  Top 0.203: U1.P$17 22.09,46.49 v22.61,45.97 | R3.2 v5.08,60.96
  Route15 0.203: v5.08,60.96 5.08,52.07 10.54,46.61 14.86,46.61 16.26,45.21 20.45,45.21 21.21,45.97 v22.61,45.97
  Bottom 0.203: v5.08,60.96 6.35,59.69 TP1.P$1
N$15
  Top 0.203: U1.P$5 14.49,46.49 13.97,45.97 13.97,44.32 11.43,41.78 C6.2
N$16
  pour Top (isolate 0.203, no thermals): 16.81,17.12 16.81,14.81 15.88,13.87 15.88,11.68 15.7,11.51 14.3,11.51 14.15,11.66 14.15,14.07 14.48,14.4 15.44,14.4 16.69,15.65 16.71,15.67 16.74,15.7 16.74,17.12
N$17
  Top 0.203: LED1.C 8.37,63.6 R7.1
N$18
  pour Top (isolate 0.203, no thermals): 18.75,17.12 18.75,14.81 19.68,13.87 19.68,11.68 19.86,11.51 21.26,11.51 21.41,11.66 21.41,14.07 21.08,14.4 20.12,14.4 18.87,15.65 18.85,15.67 18.82,15.7 18.82,17.12
N$19
  Top 0.203: U3.P$6 20.94,20.05 21.08,20.19 21.08,22.23 22.86,24 C13.1
N$20
  Top 0.203: U3.P$8 19.67,21.45 19.94,21.72 19.94,22.1 21.59,23.75 C14.1
N$21
  Top 0.203: U3.P$13 16.78,22.46 16.38,22.86 16,22.86 15.24,23.62 R13.1
N$22  (via drill 0.38)
  Top 0.203: U3.P$17 13.6,19.55 v12.95,20.19 | R10.2 v4.95,5.08
  Route2 0.203: v9.78,19.18 9.78,16.13 9.27,15.62 9.27,9.4 v4.95,5.08
  Route15 0.203: v9.78,19.18 11.94,19.18 v12.95,20.19
  Bottom 0.203: v4.95,5.08 6.22,5.08 TP4.P$1
N$23
  Top 0.203: U3.P$4 21.34,19.05 22.1,19.81 22.1,21.34 25.02,24.26 25.02,25.78 24.75,26.05 C12.1
N$24  (via drill 0.38)
  Top 0.203: R2.1 R35.2 v39.88,36.83
  Bottom 0.203: v39.88,36.83 40.89,36.83 42.36,35.36 SJ1.1
N$25
  Top 0.203: U3.P$5 21.07,19.55 21.59,20.07 21.59,21.59 24.13,24.13 C12.2
N$26
  Top 0.203: R14.1 8.27,1.37 LED2.C
N$27
  Top 0.203: R36.2 3.91,41.26 LED5.C
N$28
  Top 0.203: R10.3 9.07,6.82 R49.1
N$29
  pour Top (isolate 0.203, no thermals): 17.22,17.09 17.22,14.5 16.38,13.67 16.38,11.33 15.65,10.59 15.65,2.95 15.77,2.82 17.22,2.84 17.37,2.95 17.37,17.09
N$30
  pour Top (isolate 0.203, no thermals): 18.34,17.09 18.34,14.5 19.18,13.67 19.18,11.33 19.91,10.59 19.91,5.49 20.47,4.78 20.47,2.84 18.64,2.87 18.64,4.75 18.19,5.05 18.19,17.09
N$31  (via drill 0.38)
  other vias: 21.56,16.51
  pour Top (isolate 0.203, no thermals): 19.71,17.45 20.07,17.45 21.34,16.18 21.39,16.13 21.89,16.13 21.97,16.21 21.97,16.56 20.95,17.58 19.71,17.58
  pour Bottom (isolate 0.203, no thermals): 21.79,16.92 22.43,16.28 22.43,7.44 24.56,5.05 24.56,3.07 24.33,2.84 22.45,2.84 22.35,2.95 22.35,4.6 20.73,6.48 20.73,15.34 21.08,15.7 21.08,16.69 21.31,16.92
N$32
  pour Top (isolate 0.203, no thermals): 33.32,17.12 33.32,14.81 32.38,13.87 32.38,11.68 32.21,11.51 30.81,11.51 30.66,11.66 30.66,14.07 30.99,14.4 31.95,14.4 33.2,15.65 33.22,15.67 33.25,15.7 33.25,17.12
N$33
  pour Top (isolate 0.203, no thermals): 35.26,17.12 35.26,14.81 36.2,13.87 36.2,11.68 36.37,11.51 37.77,11.51 37.92,11.66 37.92,14.07 37.59,14.4 36.63,14.4 35.38,15.65 35.36,15.67 35.33,15.7 35.33,17.12
N$34
  Top 0.203: U4.P$6 37.45,20.05 37.59,20.19 37.59,22.23 39.37,24 C19.1
N$35
  Top 0.203: U4.P$8 36.31,21.45 36.58,21.72 36.58,22.23 38.1,23.75 C20.1
N$36
  Top 0.203: U4.P$13 33.29,22.59 33.02,22.86 32,22.86 31.75,23.11 R20.1
N$37  (via drill 0.38)
  Top 0.203: U4.P$17 30.11,19.55 v29.46,20.19 | R17.2 v47.12,5.08
  Route2 0.203: v47.12,5.08 47.12,24.51 46.48,25.15 42.93,25.15 38.86,21.08 32,21.08 31.11,20.19 v29.46,20.19
  Bottom 0.203: TP3.P$1 46.35,6.48 47.12,5.71 v47.12,5.08
N$38
  Top 0.203: U4.P$4 37.72,19.05 38.48,19.81 38.48,21.21 41.53,24.26 41.53,25.91 41.39,26.05 C18.1
N$39
  Top 0.203: U4.P$5 37.58,19.55 38.1,20.07 38.1,21.46 40.64,24 C18.2
N$40
  Top 0.203: LED3.C 45.2,2.44 R21.1
N$41  (via drill 0.38)
  other vias: 38.07,49.53
  pour Top (isolate 0.203, no thermals): 36.22,48.59 36.58,48.59 37.85,49.86 37.9,49.91 38.4,49.91 38.48,49.83 38.48,49.48 37.47,48.46 36.22,48.46
  pour Bottom (isolate 0.203, no thermals): 37.64,49.12 37.67,49.12 37.69,49.1 38.25,49.1 39.12,49.96 39.12,58.29 40.59,59.77 40.59,62.87 39.98,63.47 38.46,63.47 38.02,63.04 37.31,62.33 37.21,62.23 37.21,50.83 37.52,50.52 37.52,49.25
N$42
  pour Top (isolate 0.203, no thermals): 33.73,17.09 33.73,14.5 32.89,13.67 32.89,11.33 32.16,10.59 32.13,5.64 31.24,4.75 31.24,2.82 33.43,2.87 33.43,4.75 33.88,5.05 33.88,17.09
N$43
  pour Top (isolate 0.203, no thermals): 34.85,17.09 34.85,14.5 35.69,13.67 35.69,11.33 36.42,10.59 36.42,2.95 36.3,2.82 34.47,2.82 34.37,2.92 34.37,4.72 34.7,5.05 34.7,17.09
N$44  (via drill 0.38)
  other vias: 38.07,16.51
  pour Top (isolate 0.203, no thermals): 36.22,17.45 36.58,17.45 37.85,16.18 37.9,16.13 38.4,16.13 38.48,16.21 38.48,16.56 37.47,17.58 36.22,17.58
  pour Bottom (isolate 0.203, no thermals): 37.64,16.92 37.67,16.92 37.69,16.94 38.25,16.94 39.12,16.08 39.12,7.75 40.59,6.27 40.59,3.17 39.98,2.57 38.46,2.57 38.02,3 37.31,3.71 37.21,3.81 37.21,15.21 37.52,15.52 37.52,16.79
N$45
  pour Top (isolate 0.203, no thermals): 35.26,48.92 35.26,51.23 36.2,52.17 36.2,54.36 36.37,54.53 37.77,54.53 37.92,54.38 37.92,51.97 37.59,51.64 36.63,51.64 35.38,50.39 35.36,50.37 35.33,50.34 35.33,48.92
N$46
  pour Top (isolate 0.203, no thermals): 33.32,48.92 33.32,51.23 32.38,52.17 32.38,54.36 32.21,54.53 30.81,54.53 30.66,54.38 30.66,51.97 30.99,51.64 31.95,51.64 33.2,50.39 33.22,50.37 33.25,50.34 33.25,48.92
N$47
  Top 0.203: U5.P$6 31.13,45.99 30.99,45.85 30.99,43.81 29.21,42.04 C25.1
N$48
  Top 0.203: U5.P$8 32.52,44.59 30.48,42.55 C26.1
N$49
  Top 0.203: U5.P$13 35.29,43.45 35.56,43.18 36.07,43.18 36.83,42.42 R27.1
N$50  (via drill 0.38)
  Top 0.203: U5.P$17 38.6,46.49 v39.12,45.97 | R24.2 v47.12,60.96
  Route2 0.203: v39.12,45.97 39.5,46.35 39.5,53.59 44.45,58.55 44.7,58.55 v47.12,60.96
  Bottom 0.203: TP2.P$1 45.47,59.31 v47.12,60.96
N$51
  Top 0.203: U5.P$4 30.86,46.99 29.97,46.1 29.97,44.7 27.05,41.78 27.05,40.13 27.19,39.99 C24.1
N$52
  Top 0.203: U5.P$5 31,46.49 30.48,45.97 30.48,44.45 27.94,41.91 C24.2
N$53
  Top 0.203: R28.1 45.1,64.67 LED4.C
N$54  (via drill 0.38)
  other vias: 21.56,49.53
  pour Top (isolate 0.203, no thermals): 19.71,48.59 20.07,48.59 21.34,49.86 21.39,49.91 21.89,49.91 21.97,49.83 21.97,49.48 20.95,48.46 19.71,48.46
  pour Bottom (isolate 0.203, no thermals): 21.79,49.12 22.43,49.76 22.43,58.6 24.82,60.99 24.82,62.97 24.59,63.2 22.71,63.2 22.61,63.09 22.61,61.44 20.73,59.56 20.73,50.7 21.08,50.34 21.08,49.35 21.31,49.12
N$55
  pour Top (isolate 0.203, no thermals): 34.85,48.95 34.85,51.54 35.69,52.37 35.69,54.71 36.42,55.45 36.42,63.09 36.3,63.22 34.47,63.22 34.37,63.12 34.37,61.32 34.7,60.99 34.7,48.95
N$56
  pour Top (isolate 0.203, no thermals): 33.73,48.95 33.73,51.54 32.89,52.37 32.89,54.71 32.16,55.45 32.16,60.55 31.62,61.32 31.62,63.12 33.43,63.12 33.43,61.34 33.88,60.99 33.88,48.95
N$57  (via drill 0.38)
  other vias: 30.51,49.53
  pour Top (isolate 0.203, no thermals): 32.36,48.59 32,48.59 30.73,49.86 30.68,49.91 30.18,49.91 30.1,49.83 30.1,49.48 31.11,48.46 32.36,48.46
  pour Bottom (isolate 0.203, no thermals): 30.28,49.12 29.64,49.76 29.64,58.6 27.25,60.99 27.25,62.97 27.48,63.2 29.36,63.2 29.46,63.09 29.46,61.44 31.34,59.56 31.34,50.7 30.99,50.34 30.99,49.35 30.76,49.12
N$58
  Top 0.203: R50.1 43.8,5.03 R17.3
N$59
  Top 0.203: R24.3 43,59.22 R51.1
N$60
  Top 0.203: R52.1 8.27,59.04 7.62,59.69 7.62,60.96 8.47,61.81 R3.3
RAW
  pour Top (no thermals): 11.94,37.21 3.3,37.21 2.79,36.7 2.79,33.66 3.43,33.02 9.4,33.02 12.19,35.81 12.19,37.21
RST1  (via drill 0.38)
  Top 0.203: U1.P$12 18.28,43.19 v19.05,42.42 R33.2
  Route15 0.203: JP16.8 27.94,54.61 25.4,52.07 25.4,48.9 24.89,48.39 24.89,45.34 22.73,43.18 19.81,43.18 v19.05,42.42
RST2  (via drill 0.38)
  Top 0.203: U5.P$12 34.79,43.19 v35.56,42.42 R37.2
  Route15 0.203: JP19.8 52.07,54.61 50.8,53.34 50.8,42.04 49.66,40.89 43.18,40.89 42.55,41.53 36.45,41.53 v35.56,42.42
RST3  (via drill 0.38)
  Top 0.203: U3.P$12 17.28,22.85 v16.51,23.62 R44.2
  Route15 0.203: JP17.8 48.26,8.26 42.29,2.29 9.14,2.29 6.6,4.83 6.6,20.95 11.81,26.16 13.97,26.16 v16.51,23.62
RST4  (via drill 0.38)
  Top 0.203: U4.P$12 33.79,22.85 v33.02,23.62 R48.2
  Route2 0.203: v33.02,23.62 34.04,24.64 36.96,24.64 42.55,30.23 53.98,30.23 54.36,29.84 54.36,12.45 JP18.8
SLP1  (via drill 0.38)
  Top 0.203: U1.P$14 20.31,44.59 21.59,43.31 v21.59,42.42 R34.2
  Route15 0.203: JP16.7 29.21,52.07 25.4,48.26 25.4,45.21 22.61,42.42 v21.59,42.42
SLP2  (via drill 0.38)
  Top 0.203: U5.P$14 36.82,44.59 38.1,43.31 v38.1,42.42 R29.2
  Route2 0.203: JP19.7 50.04,48.77 50.04,41.78 49.15,40.89 46.74,40.89 45.59,39.75 42.42,39.75 39.75,42.42 v38.1,42.42
SLP3  (via drill 0.38)
  Top 0.203: U3.P$14 15.25,21.45 13.97,22.73 v13.97,23.62 R15.2
  Route15 0.203: JP17.7 40.64,6.35 10.16,6.35 7.62,8.89 7.62,20.32 10.92,23.62 v13.97,23.62
SLP4  (via drill 0.38)
  Top 0.203: U4.P$14 31.76,21.45 30.48,22.73 v30.48,23.62 R22.2
  Route2 0.203: JP18.7 50.8,13.97 50.16,14.61 50.16,24.38 49.4,25.15 46.99,25.15 46.35,25.78 42.8,25.78 38.61,21.59 32.51,21.59 v30.48,23.62
STP1  (via drill 0.38)
  Top 0.203: U1.P$16 21.45,45.99 v22.61,44.83 | v5.71,64.77 LED1.A
  Route2 0.203: v22.61,44.83 24.13,43.31 24.13,39.24 v24,39.12
  Route15 0.203: JP16.1 41.27,36.83 40.39,37.72 25.91,37.72 24.51,39.12 v24,39.12 | v5.71,64.77 5.71,62.87 7.62,60.96 7.62,57.15 12.7,52.07 16.51,52.07 20.32,48.26 21.84,48.26 23.75,46.35 23.75,45.97 v22.61,44.83
STP2  (via drill 0.38)
  Top 0.203: U5.P$16 37.96,45.99 v39.12,44.83 | LED4.A v42.55,64.77
  Route2 0.203: v42.55,64.77 42.55,57.78 38.86,54.1 38.86,46.99 38.23,46.35 38.23,45.72 v39.12,44.83
  Route15 0.203: JP19.1 52.58,36.83 49.02,40.39 42.55,40.39 42.04,40.89 31.24,40.89 30.48,41.66 30.48,42.93 31.24,43.69 37.97,43.69 v39.12,44.83
STP3  (via drill 0.38)
  Top 0.203: U3.P$16 14.24,20.05 v12.95,21.34 | LED2.A v5.71,1.27
  Route2 0.203: v12.95,21.34 v12.95,27.94
  Route15 0.203: JP17.1 47.37,29.21 41.15,22.99 41.15,16.38 38.61,13.84 26.04,13.84 25.02,14.86 25.02,16.89 23.75,18.16 20.07,18.16 18.8,16.89 16.13,16.89 13.97,19.05 13.97,20.32 v12.95,21.34 | v5.71,1.27 5.71,22.1 11.18,27.56 12.57,27.56 v12.95,27.94
STP4  (via drill 0.38)
  Top 0.203: U4.P$16 30.75,20.05 v29.46,21.34 | LED3.A v41.91,1.27
  Route2 0.203: v41.91,1.27 46.99,1.27 54.99,9.27 54.86,9.4 54.86,30.1 54.23,30.73 42.16,30.73 36.7,25.27 30.73,25.27 29.46,24 v29.46,21.34
  Route15 0.203: v29.46,21.34 28.19,21.34 26.92,20.07 26.92,15.11 27.69,14.35 38.35,14.35 40.51,16.51 40.51,23.24 47.5,30.23 52.32,30.23 JP18.1
VCC  (via drill 0.38)
  Top 0.203: R1.2 v39.88,35.56 | R38.1 R39.1 R40.1 R37.1 35.56,39.12 v35.43,38.99 | v15.24,38.86 R32.1 R31.1 R8.1 R33.1 | v22.86,38.86 C9.1 R34.1 | R23.1 v25.91,15.24 | R30.1 v42.42,15.24 42.93,15.24 45.21,12.95 45.21,7.73 R50.2 | R16.1 v9.65,50.8 | R49.2 v4.95,7.62 | R9.1 26.29,50.8 v26.16,50.67 | R52.2 v5.84,58.42 | R51.2 v46.23,58.42 | U1.P$15 21.18,45.49 21.34,45.34 v21.34,44.83 | U5.P$15 37.7,45.49 37.85,45.34 v37.85,44.83 | U3.P$15 14.38,20.55 14.22,20.7 v14.22,21.34 | U4.P$15 30.89,20.55 30.73,20.7 v30.73,21.34 | v36.83,27.18 R47.1 R46.1 R45.1 R48.1 | R22.1 C21.1 29.2,26.04 v27.94,26.04 | R44.1 R41.1 R42.1 R43.1 20.32,26.92 v20.7,27.3 | v13.97,27.56 R15.1 C15.1 | LED5.A v3.81,43.81 | R29.1 C27.1 40.5,39.99 v40.51,40.01
  Top 1.016: v40.51,40.01 40.51,38.23 41.02,37.72 41.02,35.81 40.77,35.56 v39.88,35.56
  other vias: 42.93,31.75
  pour Route15 (isolate 0.305): 0,68.58 0,0 57.15,0 57.15,68.58
  pour Top (no thermals): 29.08,33.02 29.08,27.3 29.34,27.05 34.16,27.05 34.42,27.3 34.42,30.73 34.67,30.99 43.43,30.99 43.56,31.11 43.56,32.38 43.43,32.51 34.8,32.51 34.29,33.02
VIN  (via drill 0.38, 0.51)
  Top 0.203: C13.2 22.86,26.67 v24.51,28.32 25.4,29.21 25.4,31.75 | C7.2 12.7,38.1 15.24,35.56 | C25.2 29.21,39.5 28.96,39.24 26.54,39.24 22.86,35.56 | C19.2 39.37,26.8 39.75,27.18 v41.66,27.18
  Route2 1.143: 15.24,51.94 12.95,51.94 11.33,50.32 v11.33,29.97 11.33,16.61 13.97,13.97 15.24,13.97 | 15.24,51.94 20.32,51.94 | 20.32,51.94 31.75,51.94 | 31.75,51.94 34.75,51.94 v36.52,50.16 | v15.52,50.16 15.52,51.66 15.24,51.94 | v20.02,50.16 20.02,51.64 20.32,51.94 | v32.03,50.16 32.03,51.66 31.75,51.94 | 15.24,13.97 20.32,13.97 | 20.32,13.97 31.75,13.97 | 31.75,13.97 34.62,13.97 v36.52,15.88 | v15.52,15.88 15.52,14.25 15.24,13.97 | v20.02,15.88 20.02,14.28 20.32,13.97 | v32.03,15.88 32.03,14.25 31.75,13.97
  Route15 0.203: v24.51,28.32 27.56,25.27 39.75,25.27 v41.66,27.18
  other vias: 11.33,31.24
  pour Top (isolate 0.203, no thermals): 16.33,48.9 16.33,50.04 15.21,51.16 14.35,51.16 14.35,50.42 14.63,50.42 16.15,48.9
  pour Top (isolate 0.203, no thermals): 32.84,17.14 32.84,16 31.72,14.88 30.86,14.88 30.86,15.62 31.14,15.62 32.66,17.14
  pour Top (isolate 0.203, no thermals): 35.74,17.14 35.74,16 36.86,14.88 37.72,14.88 37.72,15.62 37.44,15.62 35.92,17.14
  pour Top (isolate 0.203, no thermals): 19.23,17.14 19.23,16 20.35,14.88 21.21,14.88 21.21,15.62 20.93,15.62 19.41,17.14
  pour Top (isolate 0.203, no thermals): 32.84,48.9 32.84,50.04 31.72,51.16 30.86,51.16 30.86,50.42 31.14,50.42 32.66,48.9
  pour Top (isolate 0.203, no thermals): 16.33,17.14 16.33,16 15.21,14.88 14.35,14.88 14.35,15.62 14.63,15.62 16.15,17.14
  pour Top (isolate 0.203, no thermals): 19.23,48.9 19.23,50.04 20.35,51.16 21.21,51.16 21.21,50.42 20.93,50.42 19.41,48.9
  pour Top (isolate 0.203, no thermals): 35.74,48.9 35.74,50.04 36.86,51.16 37.72,51.16 37.72,50.42 37.44,50.42 35.92,48.9
  pour Top (no thermals): 10.54,32.77 10.54,29.84 10.79,29.59 11.81,29.59 16.89,34.67 20.95,34.67 24.51,31.11 27.56,31.11 27.69,31.24 27.69,32 27.56,32.13 26.92,32.13 19.94,39.12 16.89,39.12

### Text on the board
Bottom: v020
tPlace: CH | 1 | 2 | 1 | 2 | CH | GND | RS | GND | SL | EN | M3 | M2 | power | M1 | DR | VIN | ST | <30V | GND | VCC | ST | DR | GND | M1 | QuadStep | M2 | M3 | EN | GND | SL | GND | RS | CH | CH | 3 | 4 | 3 | 4 | Cur | Adj
bPlace: close for | 3.3V